# Altium schematic sheet sd-card.SchDoc
size A
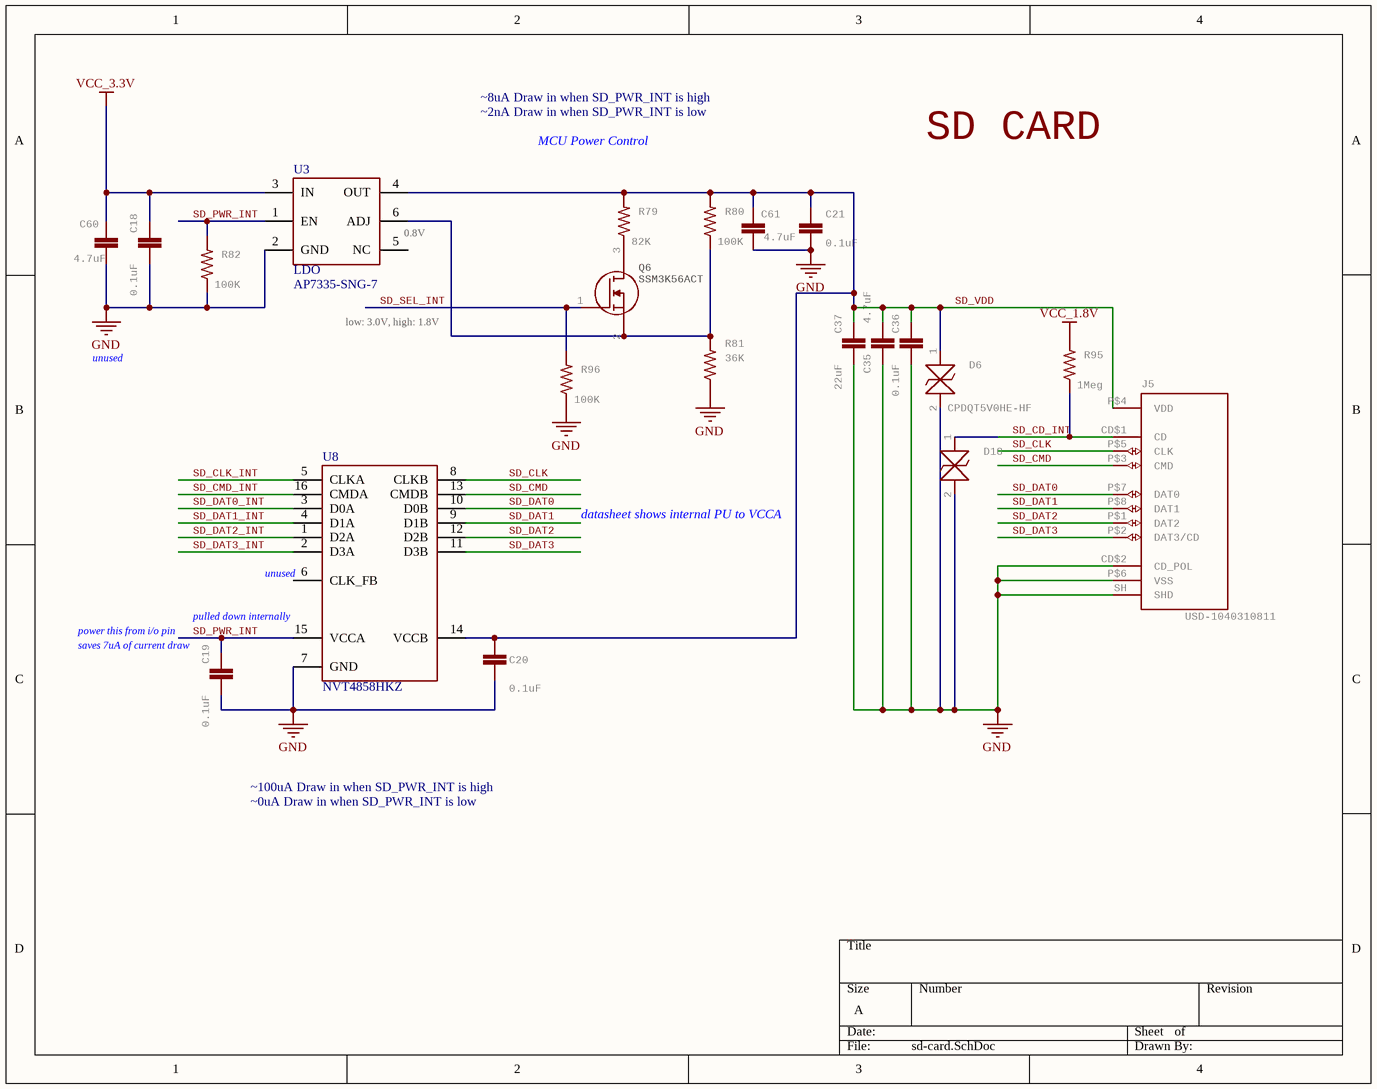
[diagram p0: sd-card.SchDoc]

## Parts
C18  0.1uF  [0402-CAP]
C19  0.1uF  [0402-CAP]
C20  0.1uF  [0402-CAP]
C21  0.1uF  [0402-CAP]
C35  4.7uF  [0402-CAP]
C36  0.1uF  [0402-CAP]
C37  22uF  [0805]
C60  4.7uF  [0402-CAP]
C61  4.7uF  [0402-CAP]
D6  CPDQT5V0HE-HF  [CPDQT5V0HEHF]
D18  CPDQT5V0HE-HF  [CPDQT5V0HEHF]  (value not drawn)
J5  USD-1040310811  [1040310811]
Q6  MPN: SSM3K56ACT  [DFN1006]  (hidden comment: NMOS)
R79  82K  [0402-RES]
R80  100K  [0402-RES]
R81  36K  [0402-RES]
R82  100K  [0402-RES]
R95  1Meg  [R0201]
R96  100K  [R0201]
U3  LDO  [DFN2020-6]
U8  NVT4858HKZ  [NVT4858HKZ]

## Nets
GND: C18.2 C19.2 C20.2 C21.2 C35.1 C36.2 C37.2 C60.2 C61.2 D6.2 D18.2 J5.CD$2(CD_POL) J5.P$6(VSS) J5.SH(SHD) R81.1 R82.1 R96.1 U3.2(GND) U8.7(GND)
VCC_1.8V: R95.2
VCC_3.3V: C18.1 C60.1 U3.3(IN)
SD_CD_INT: D18.1 J5.CD$1(CD) R95.1
SD_CLK: J5.P$5(CLK) U8.8(CLKB)
SD_CLK_INT: U8.5(CLKA)
SD_CMD: J5.P$3(CMD) U8.13(CMDB)
SD_CMD_INT: U8.16(CMDA)
SD_DAT0: J5.P$7(DAT0) U8.10(D0B)
SD_DAT0_INT: U8.3(D0A)
SD_DAT1: J5.P$8(DAT1) U8.9(D1B)
SD_DAT1_INT: U8.4(D1A)
SD_DAT2: J5.P$1(DAT2) U8.12(D2B)
SD_DAT2_INT: U8.1(D2A)
SD_DAT3: J5.P$2(DAT3/CD) U8.11(D3B)
SD_DAT3_INT: U8.2(D3A)
SD_PWR_INT: C19.1 R82.2 U3.1(EN) U8.15(VCCA)
SD_SEL_INT: Q6.1(G) R96.2
SD_VDD: C20.1 C21.1 C35.2 C36.1 C37.1 C61.1 D6.1 J5.P$4(VDD) R79.2 R80.2 U3.4(OUT) U8.14(VCCB)
NetQ6_2: Q6.2(S) R80.1 R81.2 U3.6(ADJ)
NetQ6_3: Q6.3(D) R79.1

Not connected (* = marked no-connect by the designer): U3 5(NC); U8 6(CLK_FB)

## Notes on the sheet
- ~8uA Draw in when SD_PWR_INT is high
- ~2nA Draw in when SD_PWR_INT is low
- MCU Power Control
- SD CARD
- (near U3) 0.8V
- unused
- low: 3.0V, high: 1.8V
- datasheet shows internal PU to VCCA
- (near U8) unused
- (near C19) power this from i/o pin
- (near C19) saves 7uA of current draw
- (near U8) pulled down internally
- ~0uA Draw in when SD_PWR_INT is low
- ~100uA Draw in when SD_PWR_INT is high

## Library data of the parts
C18-C21 C36 = C-EUC0201: CAPACITOR, European symbol; MPN: C0402C104Z4VAC; GateName_1: G$1; SymbolName_1: C-EU; POPULARITY: 0; LibraryName: rcl; DeviceSetName: C-EU; SPICEPREFIX: C; Part Number: C0402C104Z4VAC
C35 C60 C61 = CAP0402-CAP: CapacitorStandard 0603 ceramic capacitor, and 0.1" leaded capacitor.; MPN: JMK105BBJ475MV-F; GateName_1: G$1; SymbolName_1: CAP; DeviceName: 0402-CAP; LibraryName: sfe; DeviceSetName: CAP; Part Number: JMK105BBJ475MV-F
C37 = 22UF-0805-6.3V-20%: 22ÂµF ceramic capacitors    A capacitor is a passive two-terminal electrical component used to store electrical energy temporarily in an electric field.; MPN: CL21A226MQQNNNE; GateName_1: G$1; SymbolName_1: CAP; PROD_ID: CAP-08402; DeviceName: -0805-6.3V-20%; LibraryName: SparkFun-Capacitors; DeviceSetName: 22UF; Part Number: CL21A226MQQNNNE
D6 D18 = CPDQT5V0HE-HF: ESD Suppressors / TVS Diodes DIODE ESD 5VWM 65W 0402/SOD-923F   Source:  Datasheet; MANUFACTURER_NAME: Comchip Technology; GateName_1: G$1; SymbolName_1: CPDQT5V0HE-HF; LibraryName: CPDQT5V0HE-HF; DeviceSetName: CPDQT5V0HE-HF; HEIGHT: 0.42mm; MANUFACTURER_PART_NUMBER: CPDQT5V0HE-HF; MOUSER_PART_NUMBER: MOUSER_PART_NUMBER; MOUSER_PRICE-STOCK: MOUSER_PRICE-STOCK; MPN: CPDQT5V0HE-HF; Part Number: CPDQT5V0HE-HF
J5 = USD-1040310811: uSD Slot; MPN: 104031-0811; GateName_1: G$1; SymbolName_1: USD; LibraryName: 1040310811; DeviceSetName: USD-1040310811; Part Number: 104031-0811
Q6 = NMOS: MF: Toshiba
R79 R81 R96 = RESISTOR0402-RES: ResistorBasic schematic elements and footprints for 0603, 1206, and PTH resistors.; GateName_1: G$1; SymbolName_1: RESISTOR; LibraryName: sfe; DeviceSetName: RESISTOR
  R79 R81: DeviceName: 0402-RES
R80 R82 = RESISTOR0402-RES: ResistorBasic schematic elements and footprints for 0603, 1206, and PTH resistors.; MPN: AC0402FR-07100KL; GateName_1: G$1; SymbolName_1: RESISTOR; DeviceName: 0402-RES; LibraryName: sfe; DeviceSetName: RESISTOR; Part Number: AC0402FR-07100KL
R95 = RESISTOR0402-RES: GateName_1: G$1; SymbolName_1: RESISTOR; LibraryName: sfe; DeviceSetName: RESISTOR
U3 = AP7335-SNG-7: MF: Diodes Inc; MPN: AP7335-SNG-7
U8 = NVT4858HKZ: MF: NXP; MPN: NVT4858HKZ